# Altium schematic sheet Smart shoe_MCU.SchDoc
size A; SheetNumber: 1; SheetTotal: 3
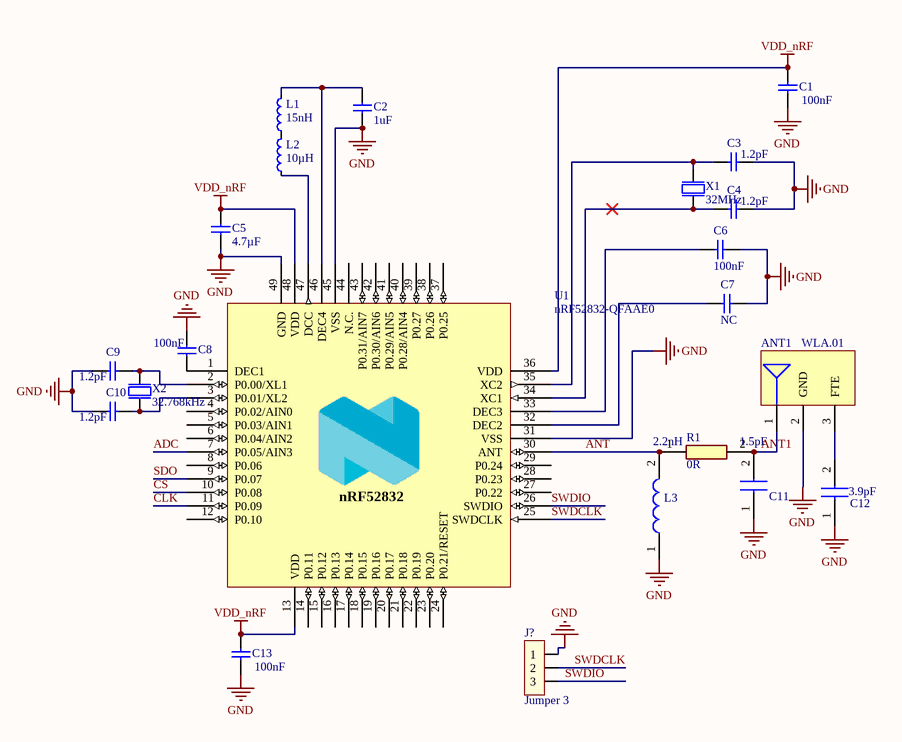
[diagram p0: Smart shoe_MCU.SchDoc]

## Parts
ANT1  WLA.01  [TAOGLAS_WLA.01]
C1  100nF  [CAPC1005X04L]
C2  1uF  [CAPC1608X06L]
C3  1.2pF  [CAPC1005X55N]
C4  1.2pF  [CAPC1005X55N]
C5  4.7µF  [CAPC1608X06L]
C6  100nF  [CAPC1005X04L]
C7  NC  [CAPC1005X55N]
C8  100nF  [CAPC1005X04L]
C9  1.2pF  [CAPC1005X04L]
C10  1.2pF  [CAPC1005X04L]
C11  1.5pF  [CAPC1005X55N]
C12  3.9pF  [CAPC1005X55N]
C13  100nF  [CAPC1005X55N]
J?  Jumper 3  [JP3]
L1  15nH  [INDC1005X04L]
L2  10µH  [INDC1608X06L]
L3  2.2nH  [INDC1005X60N]
R1  0R  [RESC1005X40N]
U1  nRF52832-QFAAE0  [QFN40P600X600X90-48N]
X1  32MHz  [BT-XTAL_2016]
X2  32.768kHz  [XTAL_3215]

## Nets
GND: ANT1.2(GND) C1.1 C2.1 C3.1 C4.1 C5.2 C6.1 C7.1 C8.2 C9.1 C10.1 C11.1 C12.1 C13.1 J?.1 L3.1 U1.31(VSS) U1.45(VSS) U1.49(GND) X1.2(GND) X1.4(GND)
VDD_nRF: C1.2 C5.1 C13.2 U1.13(VDD) U1.36(VDD) U1.48(VDD)
ADC: U1.7(P0.05/AIN3)
ANT: L3.2 R1.1 U1.30(ANT)
ANT1: ANT1.1(RF_OUT) C11.2 R1.2
CLK: U1.11(P0.09)
CS: U1.10(P0.08)
SDO: U1.9(P0.07)
SWDCLK: J?.2 U1.25(SWDCLK)
SWDIO: J?.3 U1.26(SWDIO)
NetANT1_3: ANT1.3(FTE) C12.2
NetC2_2: C2.2 L1.2 U1.46(DEC4)
NetC3_2: C3.2 U1.35(XC2) X1.3(out)
NetC4_2: C4.2 U1.34(XC1) X1.1(inp)
NetC6_2: C6.2 U1.33(DEC3)
NetC7_2: C7.2 U1.32(DEC2)
NetC8_1: C8.1 U1.1(DEC1)
NetC9_2: C9.2 U1.2(P0.00/XL1) X2.2(out)
NetC10_2: C10.2 U1.3(P0.01/XL2) X2.1(inp)
NetL1_1: L1.1 L2.2
NetL2_1: L2.1 U1.47(DCC)

Not connected (* = marked no-connect by the designer): U1 4(P0.02/AIN0) 5(P0.03/AIN1) 6(P0.04/AIN2) 8(P0.06) 12(P0.10) 14(P0.11) 15(P0.12) 16(P0.13) 17(P0.14) 18(P0.15) 19(P0.16) 20(P0.17) 21(P0.18) 22(P0.19) 23(P0.20) 24(P0.21/RESET) 27(P0.22) 28(P0.23) 29(P0.24) 37(P0.25) 38(P0.26) 39(P0.27) 40(P0.28/AIN4) 41(P0.29/AIN5) 42(P0.30/AIN6) 43(P0.31/AIN7) 44(N.C.)

## Notes on the sheet
- (in symbol nRF52832_QFAA) nRF52832

## Library data of the parts
ANT1 = TAOGLAS_WLA.01: 2.5dBi 240 0MHz to 250MHz WLAN/WIFI/Bluetooth/Zigbee; ComponentLibStatus: Created; Temp_High: +85C; Temp_Low: -40C; Datasheet: http://cdn.taoglas.com/datasheets/WLA.01.pdf; FootprintLibStatus: Created; MFG: Taoglas; MFGPN: WLA.01; RoHS: RoHS Compliant; Version: 1.0
C1 C6-C8 C13 = CAP_0402: Capacitor, NP0, ±0.1pF; Part Number: C0402-1.2p; Part number IPS: 00000005410; Value: 1.2pF; Note: 50V; Artikkelnr Noca: 20029157; Artikkelnr Simpro: N.A.; Manufacturer: *; Manufacturer Part Number: *; Datasheet: *; LatestRevisionDate: 2011-05-11; Pin Count: 2; Publisher: Nordic Semiconductor; Published: 2009-05-08; Supplier: *; Supplier part number: *; 2nd source Supplier: *; 2nd source part number: *; Footprint Doc: 0402
C2 = CAP_0603: Capacitor, X5R, ±10%; Part Number: C0603-4µ7; Part number IPS: 00000007783; Value: 4.7µF; Note: 6.3V; Artikkelnr Noca: 20069060; Artikkelnr Simpro: N.A.; Manufacturer: *; Manufacturer Part Number: *; Datasheet: *; LatestRevisionDate: 2009-11-23; Pin Count: 2; Publisher: Nordic Semiconductor; Published: 2009-05-08; Supplier: *; Supplier part number: *; 2nd source Supplier: *; 2nd source part number: *; Footprint Doc: 0603
C3 C4 C9 C10 = CAP_0402: Capacitor, NP0, ±0.1pF; Part Number: C0402-1.2p; Part number IPS: 00000005410; Note: 50V; Artikkelnr Noca: 20029157; Artikkelnr Simpro: N.A.; Manufacturer: *; Manufacturer Part Number: *; Datasheet: *; LatestRevisionDate: 2011-05-11; Pin Count: 2; Publisher: Nordic Semiconductor; Published: 2009-05-08; Value: 1.2pF; Supplier: *; Supplier part number: *; 2nd source Supplier: *; 2nd source part number: *; Footprint Doc: 0402
C5 = CAP_0603: Capacitor, X5R, ±10%; Part Number: C0603-4µ7; Part number IPS: 00000007783; Note: 6.3V; Artikkelnr Noca: 20069060; Artikkelnr Simpro: N.A.; Manufacturer: *; Manufacturer Part Number: *; Datasheet: *; LatestRevisionDate: 2009-11-23; Pin Count: 2; Publisher: Nordic Semiconductor; Published: 2009-05-08; Value: 4.7µF; Supplier: *; Supplier part number: *; 2nd source Supplier: *; 2nd source part number: *; Footprint Doc: 0603
C11 = GRM1555C1H3R9CA01D: Capacitor; Manufacturer_Name: Murata Electronics; Datasheet Link: https://datasheet.datasheetarchive.com/originals/distributors/Datasheets_SAMA/ec4f1577dddcc7a13ddad897a28002d3.pdf; Height: 0.55mm; Manufacturer_Part_Number: GRM1555C1H3R9CA01D; Mouser Part Number: 81-GRM1555C1H3R9CA1D; Mouser Price/Stock: https://www.mouser.co.uk/ProductDetail/Murata-Electronics/GRM1555C1H3R9CA01D?qs=4k9rjS6ZRl60G7lbEFmGRg%3D%3D; Arrow Part Number: GRM1555C1H3R9CA01D; Arrow Price/Stock: https://www.arrow.com/en/products/grm1555c1h3r9ca01d/murata-manufacturing
C12 = GRM1555C1H1R5CA01D: Capacitor; Manufacturer_Name: Murata Electronics; Datasheet Link: https://datasheet.datasheetarchive.com/originals/distributors/Datasheets_SAMA/ec4f1577dddcc7a13ddad897a28002d3.pdf; Height: 0.55mm; Manufacturer_Part_Number: GRM1555C1H1R5CA01D; Mouser Part Number: 81-GRM1555C1H1R5CA1D; Mouser Price/Stock: https://www.mouser.co.uk/ProductDetail/Murata-Electronics/GRM1555C1H1R5CA01D?qs=to8XolpOzrMkK3a3HyCgMg%3D%3D; Arrow Part Number: GRM1555C1H1R5CA01D; Arrow Price/Stock: https://www.arrow.com/en/products/grm1555c1h1r5ca01d/murata-manufacturing
J? = JP3: Value: J3
L1 = IND_0402: Inductor, 320mA, ±5%; Part Number: L0402-15n; Manufacturer: Taiyo Yuden; Manufacturer Part Number: HK100515NJ-T; 2nd source part number: 658-1328; Part number IPS: 00000003215; Note: High frequency chip inductor ±10%; Artikkelnr Noca: 33029323; Artikkelnr Simpro: N.A.; LatestRevisionDate: 2012-09-19; Pin Count: 2; Publisher: Nordic Semiconductor; Published: 2010-07-12; Value: 15nH; Supplier: Digi-Key; Datasheet: http://www.yuden.co.jp/productdata/catalog/en/mlci04_e.pdf; Supplier part number: 587-1521-1-ND; 2nd source Supplier: Farnell; Footprint Doc: 0402; ComponentLink1Description: Datasheet; ComponentLink2Description: Supplier link
L2 = IND_0603: Inductor, 80mA, ±10%; Part Number: L0603-10µ; Manufacturer: Taiyo Yuden; Manufacturer Part Number: LBMF1608T100K; 2nd source part number: 178-6105; Part number IPS: 00000007794; Note: LBMF1608T100K 10µH 80mA 0603; Artikkelnr Noca: 33029314; Artikkelnr Simpro: N.A.; Datasheet: http://www.yuden.co.jp/ut/product/pdf/elb2_e.pdf; LatestRevisionDate: 2012-09-19; Pin Count: 2; Publisher: Nordic Semiconductor; Published: 2010-02-24; Value: 10µH; Supplier: Digi-Key; Supplier part number: 587-1714-1-ND; 2nd source Supplier: Farnell; Footprint Doc: 0603; ComponentLink1Description: Datasheet; ComponentLink2Description: Supplier link
L3 = MLK1005S2N2ST000: Inductor; Manufacturer_Name: TDK; Datasheet Link: https://product.tdk.com/system/files/dam/doc/product/inductor/inductor/smd/catalog/inductor_commercial_high-frequency_mlk1005_en.pdf; Height: 0.6mm; Manufacturer_Part_Number: MLK1005S2N2ST000; Mouser Part Number: 810-MLK1005S2N2ST000; Mouser Price/Stock: https://www.mouser.com/Search/Refine.aspx?Keyword=810-MLK1005S2N2ST000; Arrow Part Number: MLK1005S2N2ST000; Arrow Price/Stock: https://www.arrow.com/en/products/mlk1005s2n2st000/tdk
R1 = RC0402FR070RL: Resistor; Manufacturer_Name: YAGEO (PHYCOMP); Height: 0.4mm; Manufacturer_Part_Number: RC0402FR070RL
U1 = nRF52832_QFAA: Multi-protocol Bluetooth Low Energy, ANT and 2.4GHz proprietary system-on-chip; Manufacturer: Nordic Semiconductor; Artikkelnr Noca: N.A.; Part Number: nRF52832-QFAAE0; Manufacturer Part Number: nRF52832-QFAAE0; LatestRevisionDate: 2017-10-18; Pin Count: 48; Publisher: Nordic Semiconductor; Published: 2017-10-18; Value: nRF52832-QFAAE0; Note: *; Footprint Doc: QFN-48; Part number IPS: N.A.; ComponentLink1URL: *; ComponentLink1Description: Datasheet; ComponentLink2URL: *; ComponentLink2Description: Supplier link; HelpURL: *; Supplier 1: Nordic Semiconductor; Supplier Part Number 1: nRF52832-QFAAE0; Supplier 2: *; Supplier Part Number 2: *
X1 = XTAL_2016: XTAL SMD 2016, 32MHz, Cl=8pF, Tol: ±10ppm, Stab: ±10ppm; Part Number: XTAL_SMD2016_32MHz_8pF_Epson; Manufacturer: Epson Toyocom; Manufacturer Part Number: Q22FA12800025; Note: XTAL SMD 32.000MHz; Artikkelnr Noca: 22019238; Artikkelnr Simpro: N.A.; Datasheet: http://www.epsondevice.com/docs/qd/en/DownloadServlet?id=ID000449; LatestRevisionDate: 2014-11-27; Pin Count: 4; Publisher: Nordic Semiconductor; Published: 2012-03-09; Value: 32MHz; Supplier: Farnell; Supplier part number: 171-2806; 2nd source Supplier: *; 2nd source part number: *; Footprint Doc: XTAL_2016
X2 = XTAL_3215: XTAL SMD 3215, 32.768kHz, 9pF, ±20ppm; Part Number: XTAL_FC-135 32.768k; Manufacturer: Epson Toyocom; Manufacturer Part Number: FC-135 32.768KHZ ±20PPM,9.0PF; 2nd source part number: 127-8037; Note: XTAL SMD 32.768kHz, 3215; Artikkelnr Noca: 22019091; Artikkelnr Simpro: N.A.; Datasheet: http://www.farnell.com/datasheets/57480.pdf; LatestRevisionDate: 2014-03-27; Pin Count: 2; Publisher: Nordic Semiconductor; Published: 2010-10-18; Value: 32.768kHz; Supplier: Digi-Key; Supplier part number: FC-135 32.7680KA-AC-ND; 2nd source Supplier: Farnell; Footprint Doc: XTAL_3215